# EAGLE schematic NumberMagic (EAGLE 9.4.2)
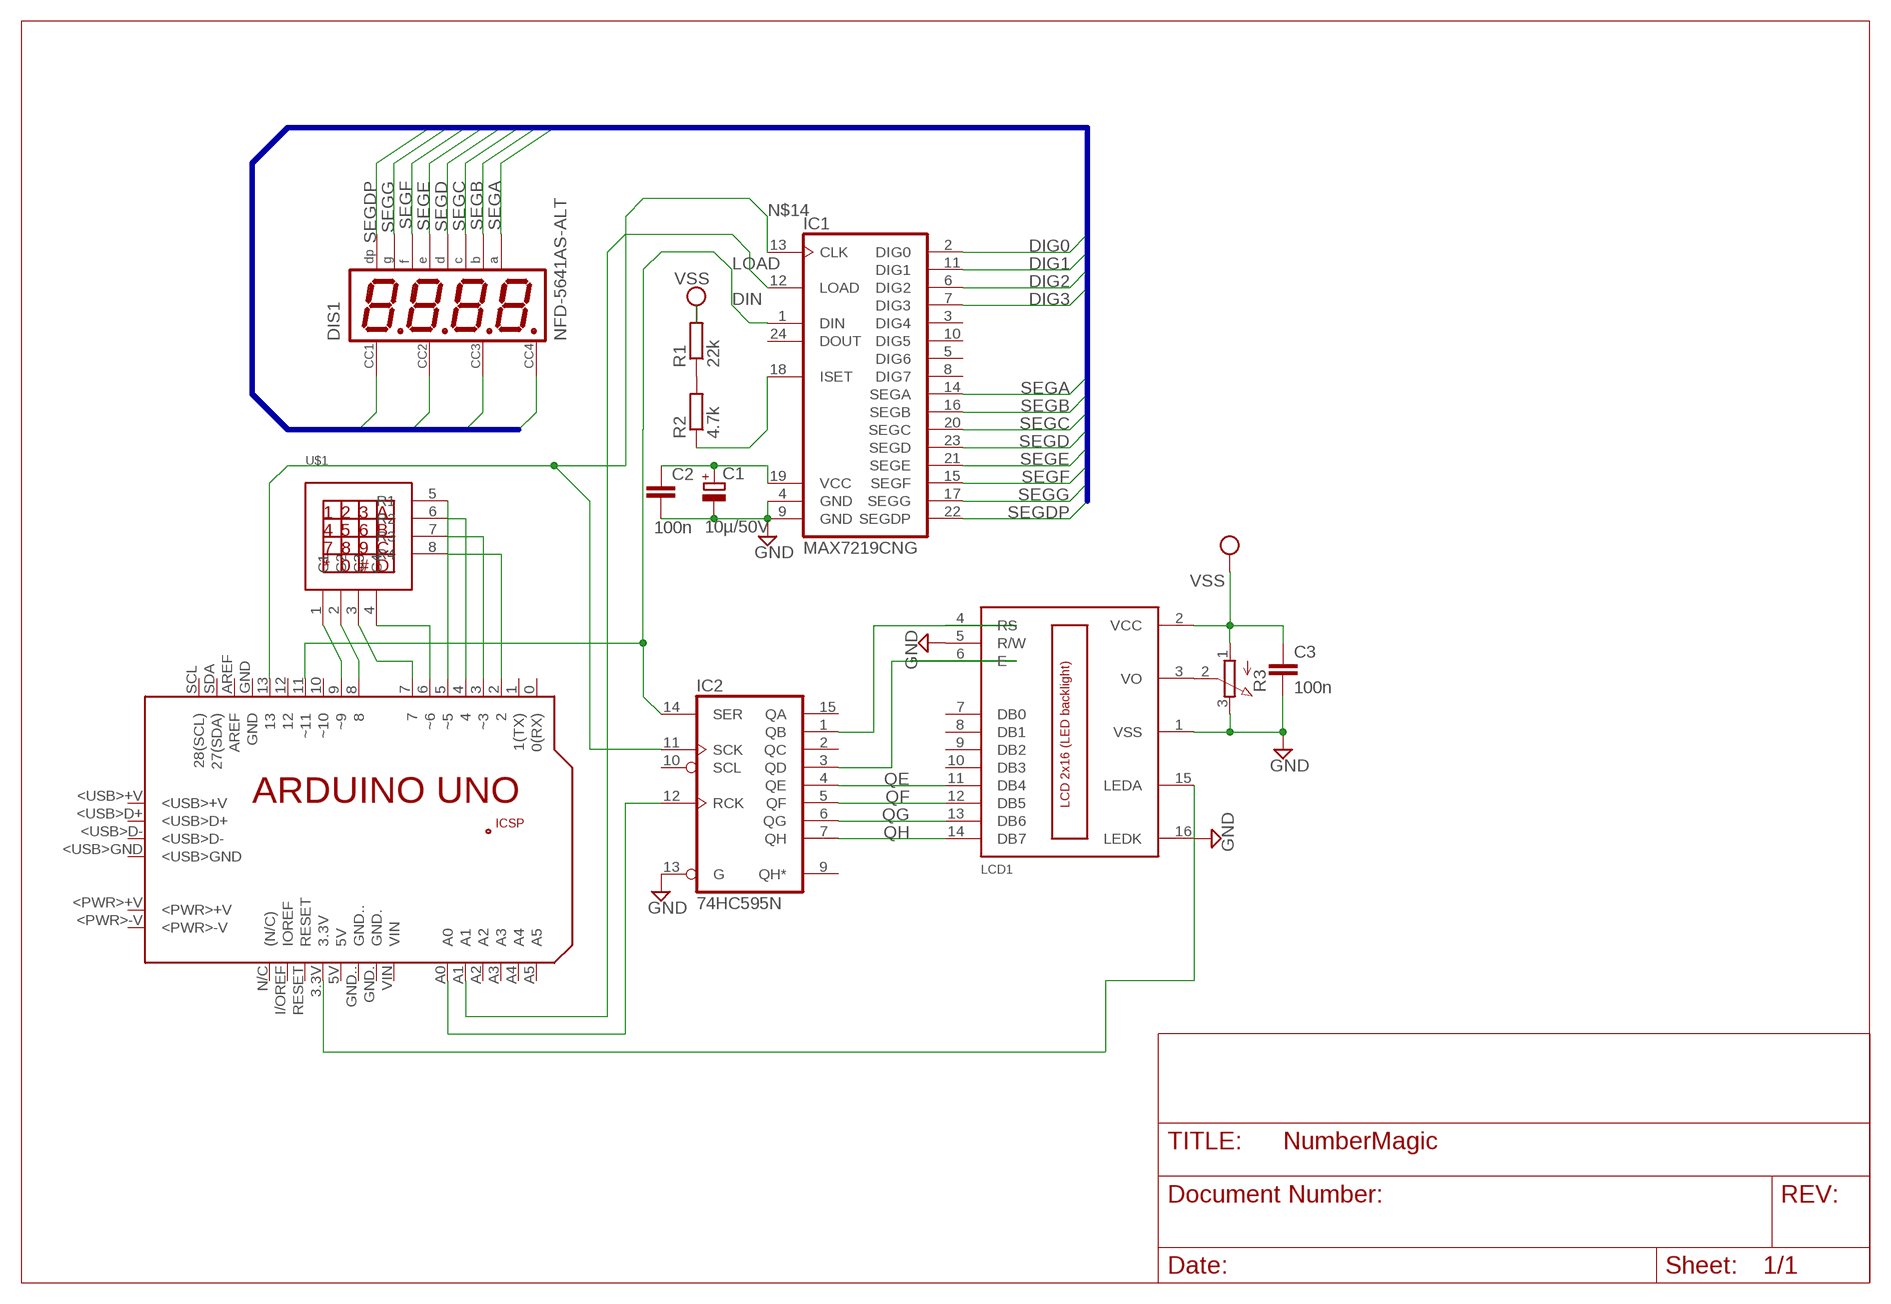
[diagram p0: schematic, sheet 1]

## Parts
C1  10µ/50V  CPOL-EUTAP5-50  [TAP5-50]
C2  100n  C-EU025-024X044  [C025-024X044]
C3  100n  C-EU025-024X044  [C025-024X044]
DIS1  NFD-5641AS-ALT  [NFD-5641]
IC1  MAX7219CNG  [DIL24-3]
IC2  74HC595N  [DIL16]
LCD1  LCD_2X16  [HY-1602F]
PCB1  ARDUINO_UNO  [ARDUINO_UNO]
R1  22k  R-EU_0204/7  [0204/7]
R2  4.7k  R-EU_0204/7  [0204/7]
R3  3RP/1610N  [3RP/1610N]
U$1  KEYPAD4X4  [KEYPAD4X4]

## Nets
DIG0: DIS1.P$12 IC1.2(DIG0)
DIG1: DIS1.P$9 IC1.11(DIG1)
DIG2: DIS1.P$8 IC1.6(DIG2)
DIG3: DIS1.P$6 IC1.7(DIG3)
DIN: IC1.1(DIN) IC2.14(SER) PCB1.11(~11)
GND: C1.- C2.2 C3.2 IC1.4(GND) IC1.9(GND) IC2.13(G) LCD1.1(VSS) LCD1.5(R/W) LCD1.16(LEDK) R3.3(E)
LOAD: IC1.12(LOAD) PCB1.A1
N$1: C1.+ C2.1 IC1.19(VCC)
N$2: LCD1.15(LEDA) PCB1.3.3V
N$3: PCB1.9(~9) U$1.1(C1)
N$4: R1.1 R2.2
N$5: IC1.18(ISET) R2.1
N$6: LCD1.3(VO) R3.2(S)
N$7: PCB1.8 U$1.2(C2)
N$8: PCB1.7 U$1.3(C3)
N$9: PCB1.6(~6) U$1.4(C4)
N$10: PCB1.2 U$1.8(R4)
N$11: PCB1.3(~3) U$1.7(R3)
N$12: PCB1.4 U$1.6(R2)
N$13: PCB1.5(~5) U$1.5(R1)
N$14: IC1.13(CLK) IC2.11(SCK) PCB1.13
N$15: IC2.12(RCK) PCB1.A0
N$16: IC2.1(QB) LCD1.4(RS)
N$17: IC2.3(QD) LCD1.6(E)
QE: IC2.4(QE) LCD1.11(DB4)
QF: IC2.5(QF) LCD1.12(DB5)
QG: IC2.6(QG) LCD1.13(DB6)
QH: IC2.7(QH) LCD1.14(DB7)
SEGA: DIS1.P$11 IC1.14(SEGA)
SEGB: DIS1.P$7 IC1.16(SEGB)
SEGC: DIS1.P$4 IC1.20(SEGC)
SEGD: DIS1.P$2 IC1.23(SEGD)
SEGDP: DIS1.P$3 IC1.22(SEGDP)
SEGE: DIS1.P$1 IC1.21(SEGE)
SEGF: DIS1.P$10 IC1.15(SEGF)
SEGG: DIS1.P$5 IC1.17(SEGG)
VSS: C3.1 LCD1.2(VCC) R1.2 R3.1(A)
Unconnected: IC1.3(DIG4) IC1.5(DIG6) IC1.8(DIG7) IC1.10(DIG5) IC1.24(DOUT) IC2.2(QC) IC2.9(QH*) IC2.10(SCL) IC2.15(QA) LCD1.7(DB0) LCD1.8(DB1) LCD1.9(DB2) LCD1.10(DB3) PCB1.0(0(RX)) PCB1.1(1(TX)) PCB1.5V PCB1.10(~10) PCB1.12 PCB1.+5V PCB1.<PWR>+V PCB1.<PWR>-V PCB1.<USB>+V PCB1.<USB>D+ PCB1.<USB>D- PCB1.<USB>GND PCB1.A2 PCB1.A3 PCB1.A4 PCB1.A5 PCB1.AREF PCB1.GND PCB1.GND. PCB1.GND.. PCB1.GND_ PCB1.I/OREF(IOREF) PCB1.MISO PCB1.MOSI PCB1.N/C((N/C)) PCB1.RESET PCB1.RESET. PCB1.SCK PCB1.SCL(28(SCL)) PCB1.SDA(27(SDA)) PCB1.VIN

## Buses
LED7SEG:DIG0,DIG1,DIG2,DIG3,SEGA,SEGB,SEGC,SEGD,SEGDP,SEGE,SEGF,SEGG

## Power pins joined to a net without a drawn wire
GND: IC2.8(GND)
VCC: IC2.16(VCC)

## Library data of the parts
C1 = rcl:CPOL-EU: POLARIZED CAPACITOR, European symbol; SPICEPREFIX: C
C2 C3 = rcl:C-EU: CAPACITOR, European symbol; SPICEPREFIX: C
DIS1 = display-nfd:NFD-5641AS-ALT: Four Digit 0.56" CC Seven-Segment LED Display Futurlec part number: 7FR5641AS Created by RobG
IC1 = maxim:MAX7219CNG: LED DISPLAY DRIVER; MF: MAXIM; MPN: MAX7219CNG; OC_FARNELL: 1523914; OC_NEWARK: 34C4018
IC2 = 74xx-eu:74*595: 8-bit SHIFT REGISTER, output latch
LCD1 = lcd_2x16_led_backlight:LCD_2X16
PCB1 = E14_Arduino_revC:ARDUINO_UNO: Device for representing an Arduino Uno board with a footprint in an EAGLE design. Created by Dave Young for Element14. More EAGLE documentation at: http://www.element14.com/community/community/knode/cadsoft_eagle
R1 R2 = rcl:R-EU_: RESISTOR, European symbol; SPICEPREFIX: R
R3 = pot:3RP/1610N: 16mm Potentiometer one level Source: http://www.alphapotentiometers.net/html/16mm_pot_2.html
U$1 = keypad_4x4_raw:KEYPAD4X4